# Altium schematic sheet nRF52840.SchDoc
size A4; Date: 08-May-2020; ApprovedBy: Vijay; CheckedBy: Vijay; CompanyName: Embdes Engineering Solutions Pvt. Ltd.; DrawnBy: Sandeep G; Organization: Altium Limited; Address1: e2-s.com; DocumentNumber: ECG_BLE.PCBA; Revision: Rev1.0; SheetNumber: 3; SheetTotal: 4; ApprovedByDate: <DATE>; CheckedByDate: <DATE>; DrawnByDate: <DATE>; PageName: nRF52840; PageSetup: Record=PageOptions|CenterHorizontal=True|CenterVertical=True|PrintScale=0.71|XCorrection=1.00|YCorrection=1.00|PrintKind=1|BorderSize=5000000|LeftOffset=0|BottomOffset=0|Orientation=2|PaperLength=1000|PaperWidth=1000|Scale=100|PaperSource=15|PrintQuality=-4|MediaType=1|DitherType=10|PaperKind=Ledger.|PrintScaleMode=1; ProjectName: <Project Name>
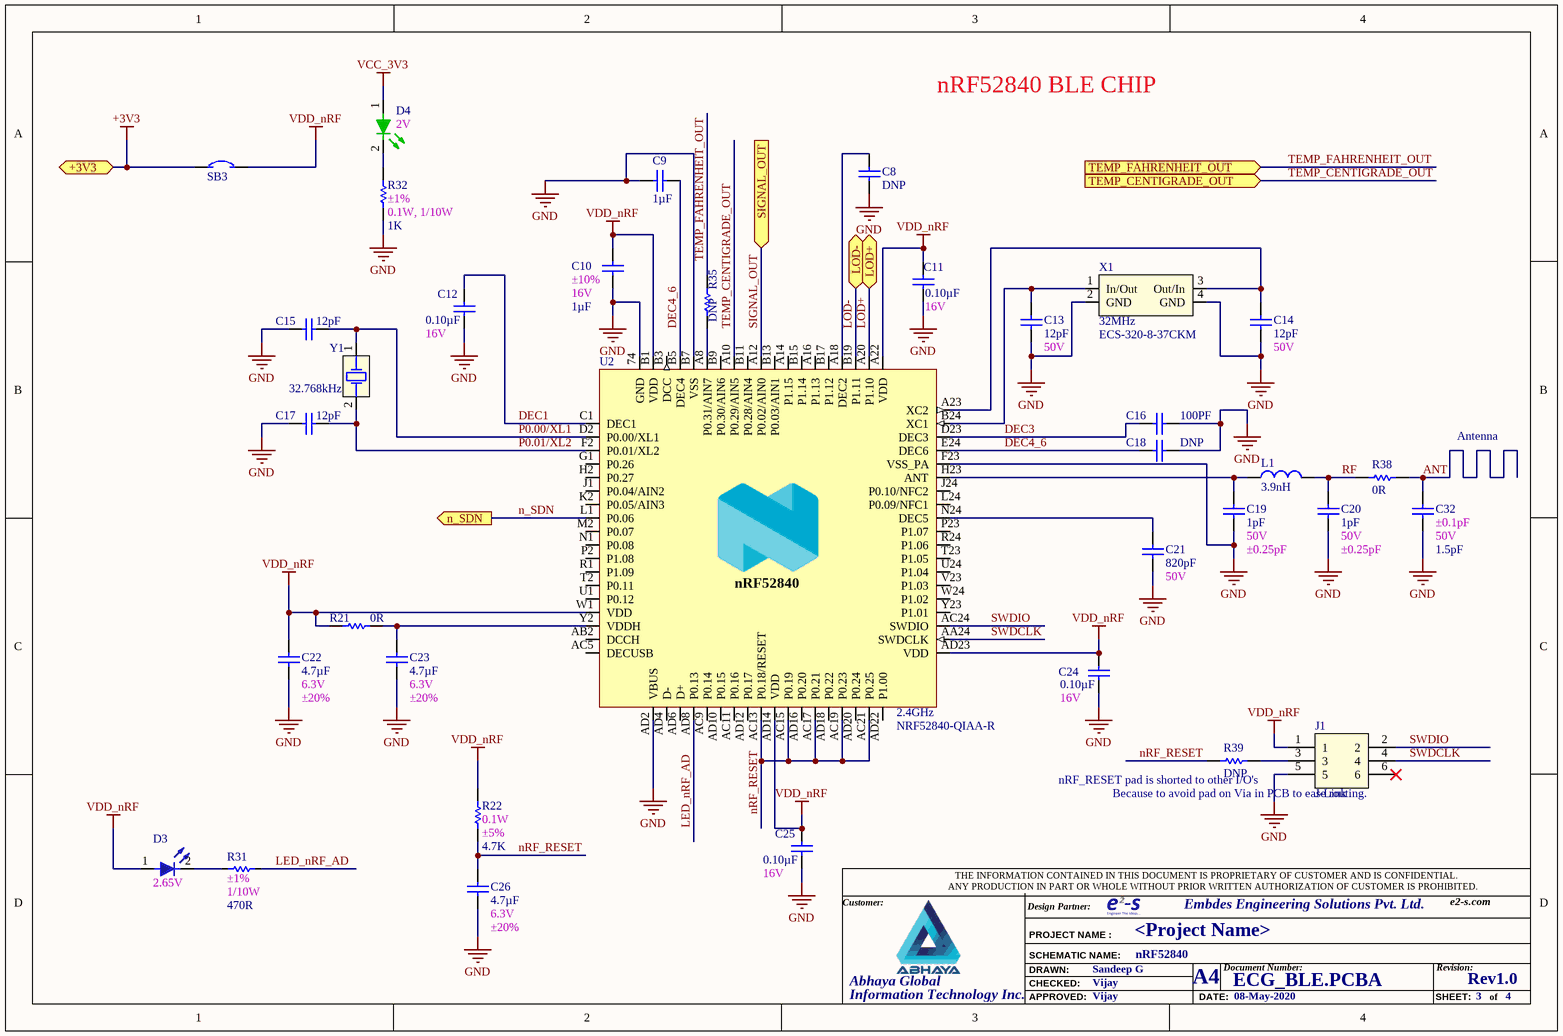
[diagram p0: nRF52840.SchDoc]

## Parts
C8  value DNP  [SMDC0402]  (hidden comment: CAP CER 100PF 25V X7RCAP CER 100PF 25V C0G/NP0 0402 0402)
C9  value 1µF  [SMDC0402]  (hidden comment: CAP CER 1UF 16V X5R 0402)
C10  value 1µF  2nd Auxiliary Field: ±10%  1st Auxiliary Field: 16V  [SMDC0402]  (hidden comment: CAP CER 1UF 16V X5R 0402)
C11  value 0.10µF  1st Auxiliary Field: 16V  [SMDC0402]  (hidden comment: CAP CER 0.1UF 16V X7R 0402)
C12  value 0.10µF  1st Auxiliary Field: 16V  [SMDC0402]  (hidden comment: CAP CER 0.1UF 16V X7R 0402)
C13  value 12pF  1st Auxiliary Field: 50V  [SMDC0402]  (hidden comment: CAP CER 12PF 50V C0G/NP0 0402)
C14  value 12pF  1st Auxiliary Field: 50V  [SMDC0402]  (hidden comment: CAP CER 12PF 50V C0G/NP0 0402)
C15  value 12pF  [SMDC0402]  (hidden comment: CAP CER 12PF 50V C0G/NP0 0402)
C16  value 100PF  [SMDC0402]  (hidden comment: CAP CER 100PF 25V X7RCAP CER 100PF 25V C0G/NP0 0402 0402)
C17  value 12pF  [SMDC0402]  (hidden comment: CAP CER 12PF 50V C0G/NP0 0402)
C18  value DNP  [SMDC0402]  (hidden comment: CAP CER 100PF 25V X7RCAP CER 100PF 25V C0G/NP0 0402 0402)
C19  value 1pF  1st Auxiliary Field: 50V  2nd Auxiliary Field: ±0.25pF  [SMDC0402]  (hidden comment: CAP CER 1PF 50V C0G/NP0 0402)
C20  value 1pF  1st Auxiliary Field: 50V  2nd Auxiliary Field: ±0.25pF  [SMDC0402]  (hidden comment: CAP CER 1PF 50V C0G/NP0 0402)
C21  value 820pF  1st Auxiliary Field: 50V  [SMDC0402]  (hidden comment: CAP CER 820PF 50V C0G/NP0 0402)
C22  value 4.7µF  1st Auxiliary Field: 6.3V  2nd Auxiliary Field: ±20%  [SMDC0402]  (hidden comment: CAP CER 4.7UF 6.3V X5R 0402)
C23  value 4.7µF  1st Auxiliary Field: 6.3V  2nd Auxiliary Field: ±20%  [SMDC0402]  (hidden comment: CAP CER 4.7UF 6.3V X5R 0402)
C24  value 0.10µF  1st Auxiliary Field: 16V  [SMDC0402]  (hidden comment: CAP CER 0.1UF 16V X7R 0402)
C25  value 0.10µF  1st Auxiliary Field: 16V  [SMDC0402]  (hidden comment: CAP CER 0.1UF 16V X7R 0402)
C26  value 4.7µF  1st Auxiliary Field: 6.3V  2nd Auxiliary Field: ±20%  [SMDC0402]  (hidden comment: CAP CER 4.7UF 6.3V X5R 0402)
C32  value 1.5pF  2nd Auxiliary Field: ±0.1pF  1st Auxiliary Field: 50V  [SMDC0402]  (hidden comment: CAP CER 1.5PF 50V NP0 0402)
D3  1st Auxiliary Field: 2.65V  [SMDLED0603]  (hidden comment: LED BLUE CLEAR 2SMD)
D4  1st Auxiliary Field: 2V  [SMDLED0603]  (hidden comment: LED GREEN CLEAR SMD)
J1  1st Auxiliary Field: J-Link  [PRG_8.06.16 J-LINK 6-PIN NEEDLE ADAPTER]  (hidden comment: J-LINK 6-PIN NEEDLE ADAPTER)
L1  value 3.9nH  [SMDL0402]  (hidden comment: FIXED IND 3.9NH 170MA 500 MOHM)
R21  value 0R  [SMDR0402]  (hidden comment: RES SMD 0.0OHM JUMPER 1/10W 0402)
R22  value 4.7K  1st Auxiliary Field: 0.1W  2nd Auxiliary Field: ±5%  [SMDR0402]  (hidden comment: RES SMD 4.7K OHM 5% 1/10W 0402)
R31  value 470R  1st Auxiliary Field: ±1%  2nd Auxiliary Field: 1/10W  [SMDR0402]  (hidden comment: RES SMD 470 OHM 1% 1/10W 0402)
R32  value 1K  2nd Auxiliary Field: ±1%  1st Auxiliary Field: 0.1W, 1/10W  [SMDR0402]  (hidden comment: RES SMD 1K OHM 1% 1/10W 0402)
R35  value DNP  [SMDR0402]  (hidden comment: RES SMD 0.0OHM JUMPER 1/10W 0402)
R38  value 0R  [SMDR0402]  (hidden comment: RES SMD 0.0OHM JUMPER 1/10W 0402)
R39  value DNP  [SMDR0402]  (hidden comment: RES SMD 0.0OHM JUMPER 1/10W 0402)
SB3  EMS_SB0805  [SB_0805]  (value not drawn)  (net tie, no BOM)
U2  value NRF52840-QIAA-R  1st Auxiliary Field: 2.4GHz  [AQFN50P700X700X85_HS-74N]  (hidden comment: IC RF TXRX+MCU 802.15.4 73VFQFN)
X1  value ECS-320-8-37CKM  1st Auxiliary Field: 32MHz  [XTAL200X160X50-4N]  (hidden comment: CRYSTAL 32.0000MHZ 8PF SMD)
Y1  1st Auxiliary Field: 32.768kHz  [XTAL325X155X80N]  (hidden comment: CRYSTAL 32.7680KHZ 12.5PF SMD)

## Ports
+3V3, LOD+, LOD-, n_SDN (out), SIGNAL_OUT (in), TEMP_CENTIGRADE_OUT (in), TEMP_FAHRENHEIT_OUT (in)

## Nets
+3V3: SB3.1 ; port +3V3
GND: C8.2 C9.1 C10.1 C11.1 C12.1 C13.1 C14.1 C15.1 C16.2 C17.1 C18.2 C19.1 C20.1 C21.1 C22.1 C23.1 C24.1 C25.1 C26.1 C32.1 J1.5 R32.2 U2.74(GND) U2.AD2(VBUS) U2.B7(VSS) U2.F23(VSS_PA) X1.2(GND) X1.4(GND)
VCC_3V3: D4.1(A)
VDD_nRF: C10.2 C11.2 C22.2 C24.2 C25.2 D3.1(A) J1.1 R21.1 R22.2 SB3.2 U2.A22(VDD) U2.AD14(VDD) U2.AD23(VDD) U2.B1(VDD) U2.W1(VDD)
ANT: C32.2 R38.2
DEC1: C12.2 U2.C1(DEC1)
DEC3: C16.1 U2.D23(DEC3)
DEC4_6: C9.2 C18.1 U2.B5(DEC4) U2.E24(DEC6)
LED_nRF_AD: R31.1 U2.AD8(P0.13)
LOD+: U2.A20(P1.10) ; port LOD+
LOD-: U2.B19(P1.11) ; port LOD-
n_SDN: U2.L1(P0.06) ; port n_SDN
nRF_RESET: C26.2 R22.1 R39.1 U2.AC13(P0.18/RESET) U2.AC15(P0.19) U2.AC17(P0.21) U2.AC19(P0.23) U2.AC21(P0.25)
P0.00/XL1: C15.2 U2.D2(P0.00/XL1) Y1.1
P0.01/XL2: C17.2 U2.F2(P0.01/XL2) Y1.2
RF: C20.2 L1.2 R38.1
SIGNAL_OUT: U2.A12(P0.02/AIN0) ; port SIGNAL_OUT
SWDCLK: J1.4 U2.AA24(SWDCLK)
SWDIO: J1.2 U2.AC24(SWDIO)
TEMP_CENTIGRADE_OUT: U2.A10(P0.29/AIN5) ; port TEMP_CENTIGRADE_OUT
TEMP_FAHRENHEIT_OUT: R35.2 ; port TEMP_FAHRENHEIT_OUT
NetC8_1: C8.1 U2.A18(DEC2)
NetC13_2: C13.2 U2.B24(XC1) X1.1(In/Out)
NetC14_2: C14.2 U2.A23(XC2) X1.3(Out/In)
NetC19_2: C19.2 L1.1 U2.H23(ANT)
NetC21_2: C21.2 U2.N24(DEC5)
NetC23_2: C23.2 R21.2 U2.Y2(VDDH)
NetD3_2: D3.2(K) R31.2
NetD4_2: D4.2(K) R32.1
NetJ1_3: J1.3 R39.2
NetR35_1: R35.1 U2.A8(P0.31/AIN7)

Not connected (* = marked no-connect by the designer): J1 6*; U2 A14(P1.15) A16(P1.13) AB2(DCCH) AC5(DECUSB) AC9(P0.14) AC11(P0.16) AD4(D-) AD6(D+) AD10(P0.15) AD12(P0.17) AD16(P0.20) AD18(P0.22) AD20(P0.24) AD22(P1.00) B3(DCC) B9(P0.30/AIN6) B11(P0.28/AIN4) B13(P0.03/AIN1) B15(P1.14) B17(P1.12) G1(P0.26) H2(P0.27) J1(P0.04/AIN2) J24(P0.10/NFC2) K2(P0.05/AIN3) L24(P0.09/NFC1) M2(P0.07) N1(P0.08) P2(P1.08) P23(P1.07) R1(P1.09) R24(P1.06) T2(P0.11) T23(P1.05) U1(P0.12) U24(P1.04) V23(P1.03) W24(P1.02) Y23(P1.01)

## Notes on the sheet
- nRF52840 BLE CHIP
- Antenna
- nRF_RESET pad is shorted to other I/O's
- (near C25) Because to avoid pad on Via in PCB to ease routing.
- Customer:
- Design Partner:
- THE INFORMATION CONTAINED IN THIS DOCUMENT IS PROPRIETARY OF CUSTOMER AND IS CONFIDENTIAL.
- ANY PRODUCTION IN PART OR WHOLE WITHOUT PRIOR WRITTEN AUTHORIZATION OF CUSTOMER IS PROHIBITED.
- Abhaya Global
- DRAWN:
- CHECKED:
- PROJECT NAME :
- SCHEMATIC NAME:
- A4
- Document Number:
- Revision:
- Information Technology Inc.
- APPROVED:
- DATE:
- SHEET:
- of
- (in symbol EICNSVFQFN-73-1863) nRF52840

## Library data of the parts
C8 C18 = ECA100P0K25V0-SB: CAP CER 100PF 25V C0G/NP0 0402; Manufacturer: KEMET; Vendor Part Number: 399-1022-1-ND; Vendor Name: Digi-Key; 3rd Auxiliary Field: ROHS3 Compliant; Component Height (mm): 0.55mm; Temp Co: -55°C ~ 125°C; 2nd Auxiliary Field: ±5%; Part Type: CAP CER 100PF 25V C0G/NP0 0402; Manufacturer Part Number: DNP; Internal Part Number: ECA100P0K25V0-SB; 1st Auxiliary Field: 25V
C9 = ECA1U00L16V0-SB: Manufacturer: Samsung Electro-Mechanics; Vendor Part Number: 1276-1067-1-ND; Manufacturer Part Number: CL05A105KO5NNNC; Vendor Name: Digi-Key; 3rd Auxiliary Field: RoHS Compliant; Component Height (mm): 0.55MM; 2nd Auxiliary Field: ±10%; Part Type: CAP CER 1UF 16V X5R 0402; Internal Part Number: ECA1U00L16V0-SB; 4th Auxiliary Field: *; Temp Co: X5R; 1st Auxiliary Field: 16V
C10 = ECA1U00L16V0-SB: Manufacturer: Samsung Electro-Mechanics; Vendor Part Number: 1276-1067-1-ND; Manufacturer Part Number: CL05A105KO5NNNC; Vendor Name: Digi-Key; 3rd Auxiliary Field: RoHS Compliant; Component Height (mm): 0.55MM; Part Type: CAP CER 1UF 16V X5R 0402; Internal Part Number: ECA1U00L16V0-SB; 4th Auxiliary Field: *; Temp Co: X5R
C11 C12 C24 C25 = ECA0U10K16V0-1-SB: Manufacturer: Samsung Electro-Mechanics America, Inc.; Manufacturer Part Number: CL05B104KO5NNNC; Vendor Part Number: 1276-1001-1-ND; Vendor Name: Digi-Key; 2nd Auxiliary Field: ±10%; Temp Co: X7R; Internal Part Number: ECA0U10K16V0-1-SB; 3rd Auxiliary Field: *; Component Height (mm): *; Part Type: CAP CER 0.1UF 16V X7R 0402; 4th Auxiliary Field: *
C13-C15 C17 = ECA12P0K50V0-SB: Manufacturer: KEMET; Manufacturer Part Number: CBR04C120J5GAC; Vendor Part Number: 399-6169-1-ND; Temp Co: -55°C ~ 125°C; 3rd Auxiliary Field: RoHS Compliant; Component Height (mm): 0.55mm; Vendor Name: Digi-Key; 2nd Auxiliary Field: ±5%; Internal Part Number: ECA12P0K50V0-SB; Part Type: CAP CER 12PF 50V C0G/NP0 0402; 4th Auxiliary Field: *
  C15 C17: 1st Auxiliary Field: 50V
C16 = ECA100P0K25V0-SB: CAP CER 100PF 25V C0G/NP0 0402; Manufacturer: KEMET; Vendor Part Number: 399-1022-1-ND; Manufacturer Part Number: C0402C101J3GACTU; Vendor Name: Digi-Key; 3rd Auxiliary Field: ROHS3 Compliant; Component Height (mm): 0.55mm; Temp Co: -55°C ~ 125°C; 2nd Auxiliary Field: ±5%; Part Type: CAP CER 100PF 25V C0G/NP0 0402; Internal Part Number: ECA100P0K25V0-SB; 1st Auxiliary Field: 25V
C19 C20 = ECA1P00V50V0-SB: Manufacturer: Samsung Electro-Mechanics; Manufacturer Part Number: CL05C010CB5NNNC; Vendor Part Number: 1276-1595-1-ND; Temp Co: -55°C ~ 125°C; 3rd Auxiliary Field: RoHS Compliant; Component Height (mm): 0.55mm; Vendor Name: Digi-Key; Internal Part Number: ECA1P00V50V0-SB; Part Type: CAP CER 1PF 50V C0G/NP0 0402; 4th Auxiliary Field: *
C21 = ECA820PK50V0-SB: Manufacturer: Samsung Electro-Mechanics; Manufacturer Part Number: CL05C821JB5NNNC; Vendor Part Number: 1276-1727-1-ND; Temp Co: -55°C ~ 125°C; 3rd Auxiliary Field: ROHS3 Compliant; Component Height (mm): 0.55mm; Vendor Name: Digi-Key; 2nd Auxiliary Field: ±5%; Internal Part Number: ECA820PK50V0-SB; Part Type: CAP CER 820PF 50V C0G/NP0 0402; 4th Auxiliary Field: *
C22 C23 C26 = ECA4U70N6V30-SB: Manufacturer: Murata Electronics North America; Manufacturer Part Number: GRM155R60J475ME47D; Vendor Part Number: 490-5915-1-ND; Temp Co: -55°C ~ 85°C; 3rd Auxiliary Field: RoHS Compliant; Component Height (mm): 0.60mm; Vendor Name: Digi-Key; Internal Part Number: ECA4U70N6V30-SB; Part Type: CAP CER 4.7UF 6.3V X5R 0402; 4th Auxiliary Field: *
C32 = ECA1P50D50V0-SB: Manufacturer: Murata Electronics North America; Vendor Part Number: 490-8087-1-ND; Manufacturer Part Number: GJM1555C1H1R5BB01D; Vendor Name: Digi-Key; Temp Co: C0G, NP0; Part Type: CAP CER 1.5PF 50V NP0 0402; 3rd Auxiliary Field: *; Internal Part Number: ECA1P50D50V0-SB; 4th Auxiliary Field: *; Component Height (mm): *
D3 = ELDB2V652M00-SC: Manufacturer: Kingbright; Vendor Part Number: 754-1933-1-ND; Manufacturer Part Number: APT1608LVBC/D; Vendor Name: Digi-Key; 2nd Auxiliary Field: 2mA; 3rd Auxiliary Field: RoHS Compliant; Component Height (mm): 0.75mm; Value: APT1608LVBC/D; Part Type: LED BLUE CLEAR 2SMD; Internal Part Number: ELDB2V652M00-SC; 4th Auxiliary Field: *; Temp Co: *
D4 = ELDG2V0020M0-SC: Manufacturer: Lite-On Inc.; Vendor Part Number: 160-1446-1-ND; Manufacturer Part Number: LTST-C191KGKT; Vendor Name: Digi-Key; 2nd Auxiliary Field: 20mA; 3rd Auxiliary Field: RoHS Compliant; Component Height (mm): 0.55mm; Value: LTST-C191KGKT; Part Type: LED GREEN CLEAR SMD; Internal Part Number: ELDG2V0020M0-SC; 4th Auxiliary Field: *; Temp Co: *
J1 = EMS-8.06.16 J-LINK 6-PIN NEEDLE ADAPTER: Manufacturer: Segger Microcontroller Systems; Vendor Part Number: 899-1051-ND; 3rd Auxiliary Field: RoHS Compliant; Vendor Name: Digi-Key; 2nd Auxiliary Field: *; 4th Auxiliary Field: *; Internal Part Number: EMS-8.06.16 J-LINK 6-PIN NEEDLE ADAPTER; Part Type: J-LINK 6-PIN NEEDLE ADAPTER; Temp Co: *; Manufacturer Part Number: 8.06.16 J-LINK 6-PIN NEEDLE ADAPTER; Value: 8.06.16 J-LINK 6-PIN NEEDLE ADAPTER
L1 = EIN3N90T170M-SB: Manufacturer Part Number: LQP15MN3N9B02D; Manufacturer: Murata Electronics North America; Vendor Part Number: 490-1131-1-ND; 3rd Auxiliary Field: RoHS Compliant; Component Height (mm): 0.45mm; Temp Co: -40°C ~ 85°C; Vendor Name: Digi-Key; 2nd Auxiliary Field: 500 mOhm Max; Internal Part Number: EIN3N90T170M-SB; Part Type: FIXED IND 3.9NH 170MA 500 MOHM; 4th Auxiliary Field: *; 1st Auxiliary Field: 170mA
R21 R35 R38 = ERE0R00110-SB: Manufacturer: Panasonic Electronic Components; Vendor Part Number: P0.0JCT-ND; Manufacturer Part Number: ERJ-2GE0R00X; Vendor Name: Digi-Key; Component Height (mm): 0.40mm; 1st Auxiliary Field: 0.1W; Part Type: RES SMD 0.0OHM JUMPER 1/10W 0402; Internal Part Number: ERE0R00110-SB; Temp Co: *; 2nd Auxiliary Field: Jumper
R22 = ERE4K70J110-SB: Manufacturer Part Number: ERJ-2GEJ472X; Manufacturer: Panasonic Electronic Components; Vendor Part Number: P4.7KJCT-ND; Component Height (mm): 0.40mm; Temp Co: ±200ppm/°C; Vendor Name: Digi-Key; Internal Part Number: ERE4K70J110-SB; 3rd Auxiliary Field: *; Part Type: RES SMD 4.7K OHM 5% 1/10W 0402; 4th Auxiliary Field: *
R31 = ERE470RG110-SB: Manufacturer Part Number: ERJ-2RKF4700X; Manufacturer: Panasonic Electronic Components; Vendor Part Number: P470LCT-ND; Component Height (mm): 0.40mm; Temp Co: ±100ppm/°C; Vendor Name: Digi-Key; 3rd Auxiliary Field: *; Internal Part Number: ERE470RG110-SB; Part Type: RES SMD 470 OHM 1% 1/10W 0402; 4th Auxiliary Field: *
R32 = ERE1K00G110-SB_1: Manufacturer: Panasonic Electronic Components; Vendor Part Number: P1.00KLCT-ND; Manufacturer Part Number: ERJ-2RKF1001X; Vendor Name: Digi-Key; 3rd Auxiliary Field: RoHS Compliant; Component Height (mm): 0.40mm; Temp Co: ±100ppm/°C; Part Type: RES SMD 1K OHM 1% 1/10W 0402; Internal Part Number: ERE1K00G110-SB
R39 = ERE0R00110-SB: Manufacturer: Panasonic Electronic Components; Vendor Part Number: P0.0JCT-ND; Vendor Name: Digi-Key; Component Height (mm): 0.40mm; 1st Auxiliary Field: 0.1W; Part Type: RES SMD 0.0OHM JUMPER 1/10W 0402; Manufacturer Part Number: DNP; Internal Part Number: ERE0R00110-SB; Temp Co: *; 2nd Auxiliary Field: Jumper
SB3 = EMS_SB0805: *; Manufacturer: *; Part Type: *; Vendor Name: *; Vendor Part Number: *; 3rd Auxiliary Field: *; Manufacturer Part Number: *; Internal Part Number: EMS_SB0805; 4th Auxiliary Field: *; Component Height (mm): *; Temp Co: *; 2nd Auxiliary Field: *; 1st Auxiliary Field: *; Value: *
U2 = EICNSVFQFN-73-1863: Manufacturer: Nordic Semiconductor ASA; Vendor Part Number: 1490-1071-1-ND; 2nd Auxiliary Field: 1.7V ~ 5.5V; 3rd Auxiliary Field: ROHS3 Compliant; 4th Auxiliary Field: 2Mbps; Component Height (mm): 0.85mm; Temp Co: -40°C ~ 85°C; Vendor Name: Digi-Key; Internal Part Number: EICNSVFQFN-73-1863; Part Type: IC RF TXRX+MCU 802.15.4 73VFQFN; Manufacturer Part Number: NRF52840-QIAA-R
X1 = EMS-ECS-320-8-37CKM: Manufacturer: ECS Inc.; Vendor Part Number: XC1547CT-ND; 3rd Auxiliary Field: RoHS Compliant; Component Height (mm): 0.55mm; Temp Co: -20°C ~ 70°C; Vendor Name: Digi-Key; 2nd Auxiliary Field: 8pF; 4th Auxiliary Field: *; Internal Part Number: EMS-ECS-320-8-37CKM; Part Type: CRYSTAL 32.0000MHZ 8PF SMD; Manufacturer Part Number: ECS-320-8-37CKM
Y1 = EMS-ABS07-32.768KHZ-T: Manufacturer: Abracon LLC; Vendor Part Number: 535-9542-1-ND; 2nd Auxiliary Field: ±20ppm; 3rd Auxiliary Field: RoHS Compliant; Component Height (mm): 0.9mm; Temp Co: -40°C ~ 85°C; Vendor Name: Digi-Key; 4th Auxiliary Field: *; Internal Part Number: EMS-ABS07-32.768KHZ-T; Part Type: CRYSTAL 32.7680KHZ 12.5PF SMD; Manufacturer Part Number: ABS07-32.768KHZ-T; Value: ABS07-32.768KHZ-T